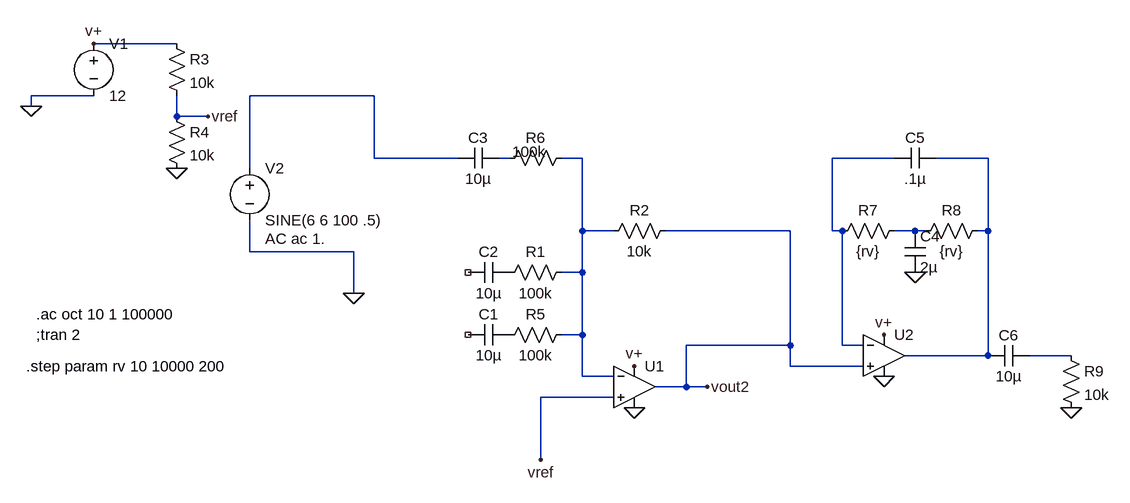
[diagram p0: schematic sum-and-filter.asc]
sum-and-filter.asc, the LTspice schematic file:
Version 4
SHEET 1 3860 680
WIRE 2416 -640 2288 -640
WIRE 2288 -560 2192 -560
WIRE 2720 -560 2528 -560
WIRE 2192 -544 2192 -560
WIRE 2416 -528 2416 -560
WIRE 2464 -528 2416 -528
WIRE 2720 -464 2720 -560
WIRE 2848 -464 2720 -464
WIRE 2928 -464 2912 -464
WIRE 3040 -464 3008 -464
WIRE 3520 -464 3424 -464
WIRE 3664 -464 3584 -464
WIRE 2528 -448 2528 -560
WIRE 3040 -352 3040 -464
WIRE 3088 -352 3040 -352
WIRE 3360 -352 3168 -352
WIRE 3424 -352 3424 -464
WIRE 3440 -352 3424 -352
WIRE 3552 -352 3520 -352
WIRE 3568 -352 3552 -352
WIRE 3664 -352 3664 -464
WIRE 3664 -352 3648 -352
WIRE 2528 -320 2528 -368
WIRE 2688 -320 2528 -320
WIRE 3040 -288 3040 -352
WIRE 3040 -288 3008 -288
WIRE 2688 -256 2688 -320
WIRE 3040 -192 3040 -288
WIRE 3040 -192 3008 -192
WIRE 3360 -176 3360 -352
WIRE 3360 -176 3200 -176
WIRE 3440 -176 3440 -352
WIRE 3472 -176 3440 -176
WIRE 3664 -160 3664 -352
WIRE 3664 -160 3536 -160
WIRE 3792 -160 3728 -160
WIRE 3360 -144 3360 -176
WIRE 3472 -144 3360 -144
WIRE 3040 -128 3040 -192
WIRE 3088 -128 3040 -128
WIRE 3200 -112 3200 -176
WIRE 3200 -112 3152 -112
WIRE 3232 -112 3200 -112
WIRE 3088 -96 2976 -96
WIRE 2976 0 2976 -96
FLAG 2688 -256 0
FLAG 2192 -544 0
FLAG 2288 -640 v+
FLAG 3120 -144 v+
FLAG 3232 -112 vout2
FLAG 2464 -528 vref
FLAG 2416 -448 0
FLAG 2976 0 vref
FLAG 3120 -80 0
FLAG 3504 -192 v+
FLAG 3504 -128 0
FLAG 3552 -288 0
FLAG 3792 -80 0
SYMBOL voltage 2288 -656 R0
WINDOW 123 0 0 Left 2
WINDOW 39 0 0 Left 2
SYMATTR InstName V1
SYMATTR Value 12
SYMBOL voltage 2528 -464 R0
WINDOW 123 24 124 Left 2
WINDOW 39 0 0 Left 2
SYMATTR Value2 AC ac 1.
SYMATTR InstName V2
SYMATTR Value SINE(6 6 100 .5)
SYMBOL Opamps\\UniversalOpamp2 3120 -112 R0
SYMATTR InstName U1
SYMBOL res 3184 -368 R90
WINDOW 0 0 56 VBottom 2
WINDOW 3 32 56 VTop 2
SYMATTR InstName R2
SYMATTR Value 10k
SYMBOL cap 2912 -480 R90
WINDOW 0 0 32 VBottom 2
WINDOW 3 32 32 VTop 2
SYMATTR InstName C3
SYMATTR Value 10µ
SYMBOL res 2400 -656 R0
SYMATTR InstName R3
SYMATTR Value 10k
SYMBOL res 2400 -544 R0
SYMATTR InstName R4
SYMATTR Value 10k
SYMBOL cap 2928 -208 R90
WINDOW 0 0 32 VBottom 2
WINDOW 3 32 32 VTop 2
SYMATTR InstName C1
SYMATTR Value 10µ
SYMBOL cap 2928 -304 R90
WINDOW 0 0 32 VBottom 2
WINDOW 3 32 32 VTop 2
SYMATTR InstName C2
SYMATTR Value 10µ
SYMBOL res 3024 -304 R90
WINDOW 0 0 56 VBottom 2
WINDOW 3 32 56 VTop 2
SYMATTR InstName R1
SYMATTR Value 100k
SYMBOL res 3024 -208 R90
WINDOW 0 0 56 VBottom 2
WINDOW 3 32 56 VTop 2
SYMATTR InstName R5
SYMATTR Value 100k
SYMBOL res 3024 -480 R90
WINDOW 0 0 56 VBottom 2
WINDOW 3 -9 66 VTop 2
SYMATTR InstName R6
SYMATTR Value 100k
SYMBOL Opamps\\UniversalOpamp2 3504 -160 R0
SYMATTR InstName U2
SYMBOL res 3536 -368 R90
WINDOW 0 0 56 VBottom 2
WINDOW 3 32 56 VTop 2
SYMATTR InstName R7
SYMATTR Value {rv}
SYMBOL res 3664 -368 R90
WINDOW 0 0 56 VBottom 2
WINDOW 3 32 56 VTop 2
SYMATTR InstName R8
SYMATTR Value {rv}
SYMBOL cap 3536 -352 R0
SYMATTR InstName C4
SYMATTR Value 2µ
SYMBOL cap 3584 -480 R90
WINDOW 0 0 32 VBottom 2
WINDOW 3 32 32 VTop 2
SYMATTR InstName C5
SYMATTR Value .1µ
SYMBOL res 3776 -176 R0
SYMATTR InstName R9
SYMATTR Value 10k
SYMBOL cap 3728 -176 R90
WINDOW 0 0 32 VBottom 2
WINDOW 3 32 32 VTop 2
SYMATTR InstName C6
SYMATTR Value 10µ
TEXT 2200 -192 Left 2 !;tran 2
TEXT 2200 -224 Left 2 !.ac oct 10 1 100000
TEXT 2184 -144 Left 2 !.step param rv 10 10000 200

The netlist it stands for:
* sum-and-filter.asc
V1 v+ 0 12
V2 N001 0 SINE(6 6 100 .5) AC ac 1.
XU1 vref N003 v+ 0 vout2 level.2 Avol=1Meg GBW=10Meg Slew=10Meg ilimit=25m rail=0 Vos=0 phimargin=45 en=0 enk=0 in=0 ink=0 Rin=500Meg  ; pins IN+ IN- V+ V- OUT
R2 vout2 N003 10k
C3 N002 N001 10µ
R3 v+ vref 10k
R4 vref 0 10k
C1 P001 NC_01 10µ
C2 P002 NC_02 10µ
R1 N003 P002 100k
R5 N003 P001 100k
R6 N003 N002 100k
XU2 vout2 N004 v+ 0 N005 level.2 Avol=1Meg GBW=10Meg Slew=10Meg ilimit=25m rail=0 Vos=0 phimargin=45 en=0 enk=0 in=0 ink=0 Rin=500Meg  ; pins IN+ IN- V+ V- OUT
R7 N006 N004 {rv}
R8 N005 N006 {rv}
C4 N006 0 2µ
C5 N005 N004 .1µ
R9 N007 0 10k
C6 N007 N005 10µ
;tran 2
.ac oct 10 1 100000
.step param rv 10 10000 200
.lib UniversalOpamps2.sub
.backanno
.end